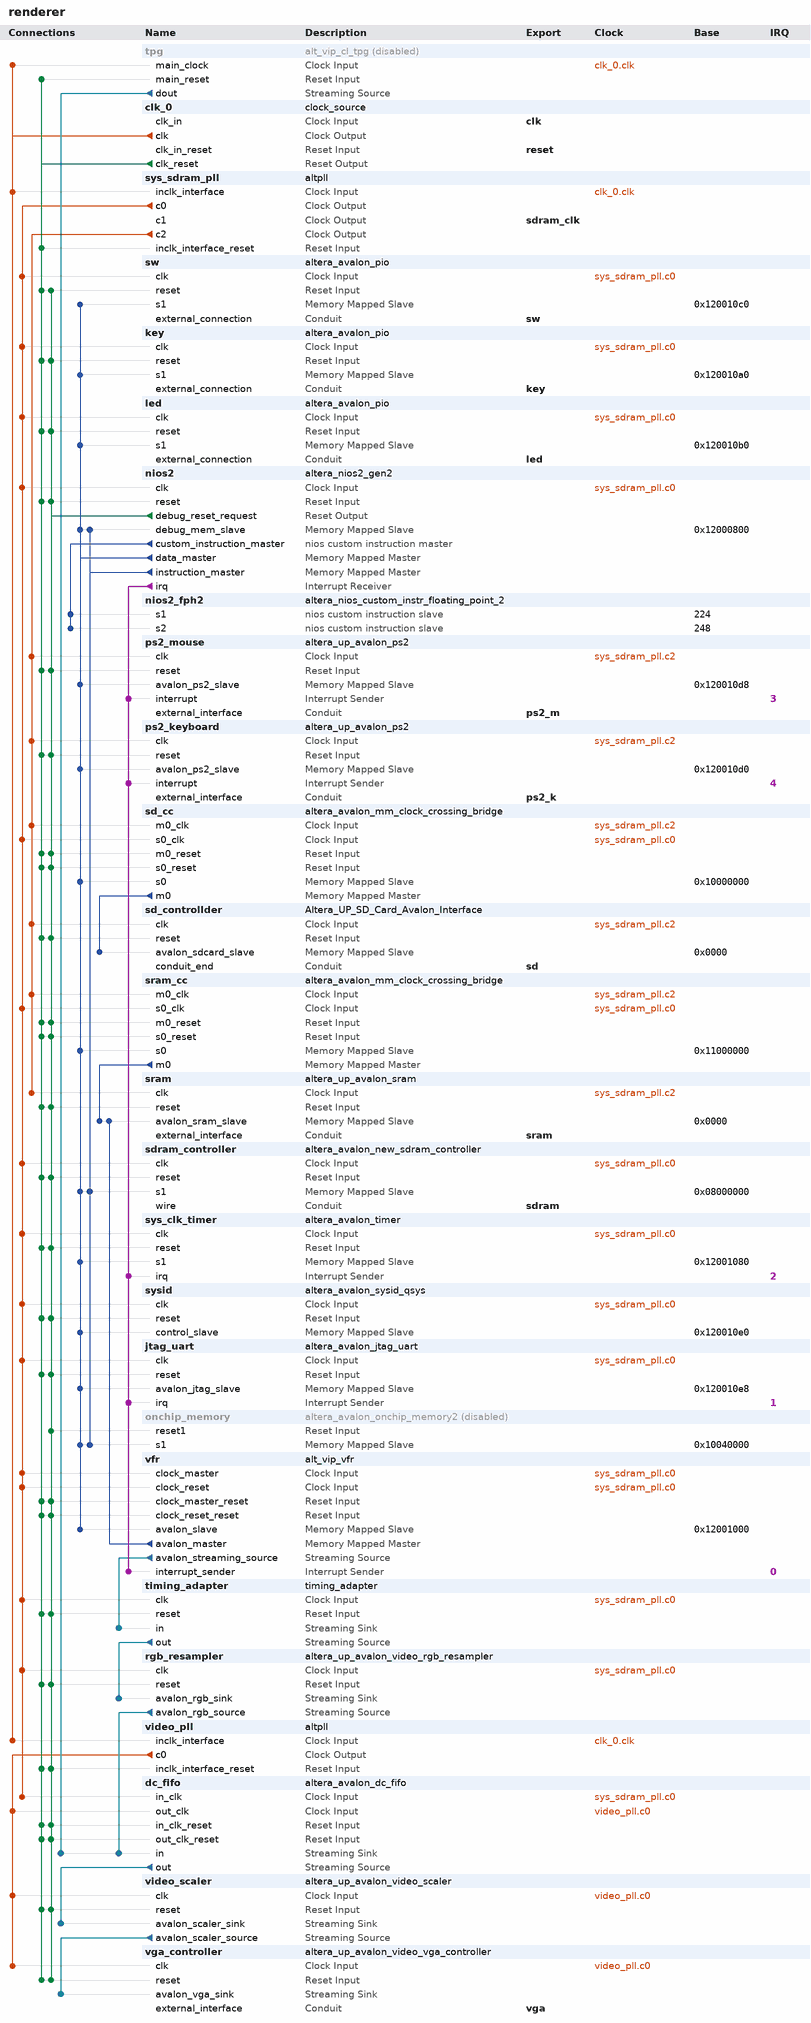
[diagram p0: system contents]
# Platform Designer (Qsys) system renderer, Cyclone IV E EP4CE115F29C7
# Parameters at their usual value, and those the tool derives, are not listed.
package require -exact qsys 16.1
create_system renderer
set_project_property DEVICE_FAMILY {Cyclone IV E}
set_project_property DEVICE EP4CE115F29C7

add_instance tpg alt_vip_cl_tpg 16.1
set_instance_property tpg ENABLED false
set_instance_parameter_value tpg BITS_PER_SYMBOL 8
set_instance_parameter_value tpg COLOR_PLANES_ARE_IN_PARALLEL 1
set_instance_parameter_value tpg COLOR_SPACE RGB
set_instance_parameter_value tpg FAMILY {Cyclone IV E}
set_instance_parameter_value tpg INTERLACING prog
set_instance_parameter_value tpg MAX_HEIGHT 480
set_instance_parameter_value tpg MAX_WIDTH 640
set_instance_parameter_value tpg NUMBER_OF_COLOR_PLANES 2
set_instance_parameter_value tpg OUTPUT_FORMAT 4.4.4
set_instance_parameter_value tpg PATTERN colorbars
set_instance_parameter_value tpg PIXELS_IN_PARALLEL 1
set_instance_parameter_value tpg RUNTIME_CONTROL 0
set_instance_parameter_value tpg UNIFORM_VALUE_BCR 16
set_instance_parameter_value tpg UNIFORM_VALUE_GCB 16
set_instance_parameter_value tpg UNIFORM_VALUE_RY 16

add_instance clk_0 clock_source 16.1
set_instance_parameter_value clk_0 clockFrequency 50000000

add_instance sys_sdram_pll altpll 16.1
set_instance_parameter_value sys_sdram_pll CLK0_DIVIDE_BY 5
set_instance_parameter_value sys_sdram_pll CLK0_MULTIPLY_BY 12
set_instance_parameter_value sys_sdram_pll CLK1_DIVIDE_BY 5
set_instance_parameter_value sys_sdram_pll CLK1_DUTY_CYCLE 50
set_instance_parameter_value sys_sdram_pll CLK1_MULTIPLY_BY 12
set_instance_parameter_value sys_sdram_pll CLK1_PHASE_SHIFT -3125
set_instance_parameter_value sys_sdram_pll CLK2_DIVIDE_BY 1
set_instance_parameter_value sys_sdram_pll CLK2_DUTY_CYCLE 50
set_instance_parameter_value sys_sdram_pll CLK2_MULTIPLY_BY 1
set_instance_parameter_value sys_sdram_pll CLK2_PHASE_SHIFT 0
set_instance_parameter_value sys_sdram_pll INCLK0_INPUT_FREQUENCY 20000
set_instance_parameter_value sys_sdram_pll PORT_ARESET PORT_USED
set_instance_parameter_value sys_sdram_pll PORT_LOCKED PORT_USED
set_instance_parameter_value sys_sdram_pll PORT_clk1 PORT_USED
set_instance_parameter_value sys_sdram_pll PORT_clk2 PORT_USED
set_instance_parameter_value sys_sdram_pll PORT_clk3 PORT_UNUSED

add_instance sw altera_avalon_pio 16.1
set_instance_parameter_value sw direction Input
set_instance_parameter_value sw width 18

add_instance key altera_avalon_pio 16.1
set_instance_parameter_value key direction Input
set_instance_parameter_value key width 4

add_instance led altera_avalon_pio 16.1
set_instance_parameter_value led direction Output
set_instance_parameter_value led width 18

add_instance nios2 altera_nios2_gen2 16.1
set_instance_parameter_value nios2 dcache_size 2048
set_instance_parameter_value nios2 exceptionSlave sdram_controller.s1
set_instance_parameter_value nios2 icache_size 4096
set_instance_parameter_value nios2 impl Fast
set_instance_parameter_value nios2 resetSlave sdram_controller.s1

add_instance nios2_fph2 altera_nios_custom_instr_floating_point_2 16.1
set_instance_parameter_value nios2_fph2 arithmetic_present true
set_instance_parameter_value nios2_fph2 comparison_present true
set_instance_parameter_value nios2_fph2 conversion_present true
set_instance_parameter_value nios2_fph2 root_present true

add_instance ps2_mouse altera_up_avalon_ps2 16.1

add_instance ps2_keyboard altera_up_avalon_ps2 16.1

add_instance sd_cc altera_avalon_mm_clock_crossing_bridge 16.1
set_instance_parameter_value sd_cc ADDRESS_WIDTH 10
set_instance_parameter_value sd_cc COMMAND_FIFO_DEPTH 4
set_instance_parameter_value sd_cc DATA_WIDTH 32
set_instance_parameter_value sd_cc MASTER_SYNC_DEPTH 2
set_instance_parameter_value sd_cc MAX_BURST_SIZE 1
set_instance_parameter_value sd_cc RESPONSE_FIFO_DEPTH 4
set_instance_parameter_value sd_cc SLAVE_SYNC_DEPTH 2
set_instance_parameter_value sd_cc USE_AUTO_ADDRESS_WIDTH 1

add_instance sd_controllder Altera_UP_SD_Card_Avalon_Interface 16.1

add_instance sram_cc altera_avalon_mm_clock_crossing_bridge 16.1
set_instance_parameter_value sram_cc ADDRESS_WIDTH 21
set_instance_parameter_value sram_cc COMMAND_FIFO_DEPTH 4
set_instance_parameter_value sram_cc DATA_WIDTH 32
set_instance_parameter_value sram_cc MASTER_SYNC_DEPTH 2
set_instance_parameter_value sram_cc MAX_BURST_SIZE 1
set_instance_parameter_value sram_cc RESPONSE_FIFO_DEPTH 4
set_instance_parameter_value sram_cc SLAVE_SYNC_DEPTH 2
set_instance_parameter_value sram_cc USE_AUTO_ADDRESS_WIDTH 1

add_instance sram altera_up_avalon_sram 16.1
set_instance_parameter_value sram board DE2-115
set_instance_parameter_value sram pixel_buffer true

add_instance sdram_controller altera_avalon_new_sdram_controller 16.1
set_instance_parameter_value sdram_controller TAC 5.4
set_instance_parameter_value sdram_controller TRCD 15.0
set_instance_parameter_value sdram_controller TRP 15.0
set_instance_parameter_value sdram_controller casLatency 3
set_instance_parameter_value sdram_controller columnWidth 10
set_instance_parameter_value sdram_controller dataWidth 32
set_instance_parameter_value sdram_controller generateSimulationModel false
set_instance_parameter_value sdram_controller model single_Micron_MT48LC4M32B2_7_chip
set_instance_parameter_value sdram_controller numberOfBanks 4
set_instance_parameter_value sdram_controller numberOfChipSelects 1
set_instance_parameter_value sdram_controller powerUpDelay 100.0
set_instance_parameter_value sdram_controller refreshPeriod 7.8125
set_instance_parameter_value sdram_controller rowWidth 13

add_instance sys_clk_timer altera_avalon_timer 16.1
set_instance_parameter_value sys_clk_timer period 1
set_instance_parameter_value sys_clk_timer periodUnits MSEC

add_instance sysid altera_avalon_sysid_qsys 16.1
set_instance_parameter_value sysid id 0

add_instance jtag_uart altera_avalon_jtag_uart 16.1
set_instance_parameter_value jtag_uart simInteractiveOptions NO_INTERACTIVE_WINDOWS

add_instance onchip_memory altera_avalon_onchip_memory2 16.1
set_instance_property onchip_memory ENABLED false
set_instance_parameter_value onchip_memory dataWidth 32
set_instance_parameter_value onchip_memory dualPort false
set_instance_parameter_value onchip_memory initMemContent true
set_instance_parameter_value onchip_memory initializationFileName onchip_mem.hex
set_instance_parameter_value onchip_memory memorySize 204800

add_instance vfr alt_vip_vfr 14.0
set_instance_parameter_value vfr MAX_IMAGE_HEIGHT 120
set_instance_parameter_value vfr MAX_IMAGE_WIDTH 160
set_instance_parameter_value vfr MEM_PORT_WIDTH 32
set_instance_parameter_value vfr NUMBER_OF_CHANNELS_IN_PARALLEL 3
set_instance_parameter_value vfr RMASTER_BURST_TARGET 128
set_instance_parameter_value vfr RMASTER_FIFO_DEPTH 256

add_instance timing_adapter timing_adapter 16.1
set_instance_parameter_value timing_adapter inBitsPerSymbol 8
set_instance_parameter_value timing_adapter inChannelWidth 0
set_instance_parameter_value timing_adapter inErrorWidth 0
set_instance_parameter_value timing_adapter inMaxChannel 0
set_instance_parameter_value timing_adapter inReadyLatency 1
set_instance_parameter_value timing_adapter inSymbolsPerBeat 3
set_instance_parameter_value timing_adapter inUseEmptyPort NO
set_instance_parameter_value timing_adapter inUsePackets true
set_instance_parameter_value timing_adapter inUseReady true
set_instance_parameter_value timing_adapter inUseValid true
set_instance_parameter_value timing_adapter outReadyLatency 1
set_instance_parameter_value timing_adapter outUseReady true
set_instance_parameter_value timing_adapter outUseValid true

add_instance rgb_resampler altera_up_avalon_video_rgb_resampler 16.1
set_instance_parameter_value rgb_resampler alpha 1023
set_instance_parameter_value rgb_resampler input_type {24-bit RGB}
set_instance_parameter_value rgb_resampler output_type {30-bit RGB}

add_instance video_pll altpll 16.1
set_instance_parameter_value video_pll CLK0_DIVIDE_BY 2
set_instance_parameter_value video_pll CLK0_MULTIPLY_BY 1
set_instance_parameter_value video_pll INCLK0_INPUT_FREQUENCY 20000
set_instance_parameter_value video_pll PORT_ARESET PORT_USED
set_instance_parameter_value video_pll PORT_LOCKED PORT_USED
set_instance_parameter_value video_pll PORT_clk1 PORT_UNUSED
set_instance_parameter_value video_pll PORT_clk2 PORT_UNUSED
set_instance_parameter_value video_pll PORT_clk3 PORT_UNUSED

add_instance dc_fifo altera_avalon_dc_fifo 16.1
set_instance_parameter_value dc_fifo BITS_PER_SYMBOL 10
set_instance_parameter_value dc_fifo FIFO_DEPTH 256
set_instance_parameter_value dc_fifo SYMBOLS_PER_BEAT 3
set_instance_parameter_value dc_fifo USE_PACKETS 1

add_instance video_scaler altera_up_avalon_video_scaler 16.1
set_instance_parameter_value video_scaler color_bits 10
set_instance_parameter_value video_scaler color_planes 3
set_instance_parameter_value video_scaler height_in 120
set_instance_parameter_value video_scaler height_scaling 4
set_instance_parameter_value video_scaler width_in 160
set_instance_parameter_value video_scaler width_scaling 4

add_instance vga_controller altera_up_avalon_video_vga_controller 16.1
set_instance_parameter_value vga_controller board DE2-115
set_instance_parameter_value vga_controller resolution {VGA 640x480}

# connections
add_connection clk_0.clk sys_sdram_pll.inclk_interface clock
add_connection clk_0.clk tpg.main_clock clock
add_connection clk_0.clk video_pll.inclk_interface clock
add_connection sys_sdram_pll.c0 dc_fifo.in_clk clock
add_connection sys_sdram_pll.c0 jtag_uart.clk clock
add_connection sys_sdram_pll.c0 key.clk clock
add_connection sys_sdram_pll.c0 led.clk clock
add_connection sys_sdram_pll.c0 nios2.clk clock
add_connection sys_sdram_pll.c0 rgb_resampler.clk clock
add_connection sys_sdram_pll.c0 sd_cc.s0_clk clock
add_connection sys_sdram_pll.c0 sdram_controller.clk clock
add_connection sys_sdram_pll.c0 sram_cc.s0_clk clock
add_connection sys_sdram_pll.c0 sw.clk clock
add_connection sys_sdram_pll.c0 sys_clk_timer.clk clock
add_connection sys_sdram_pll.c0 sysid.clk clock
add_connection sys_sdram_pll.c0 timing_adapter.clk clock
add_connection sys_sdram_pll.c0 vfr.clock_master clock
add_connection sys_sdram_pll.c0 vfr.clock_reset clock
add_connection sys_sdram_pll.c2 ps2_keyboard.clk clock
add_connection sys_sdram_pll.c2 ps2_mouse.clk clock
add_connection sys_sdram_pll.c2 sd_cc.m0_clk clock
add_connection sys_sdram_pll.c2 sd_controllder.clk clock
add_connection sys_sdram_pll.c2 sram.clk clock
add_connection sys_sdram_pll.c2 sram_cc.m0_clk clock
add_connection video_pll.c0 dc_fifo.out_clk clock
add_connection video_pll.c0 vga_controller.clk clock
add_connection video_pll.c0 video_scaler.clk clock
add_connection clk_0.clk_reset dc_fifo.in_clk_reset reset
add_connection clk_0.clk_reset dc_fifo.out_clk_reset reset
add_connection clk_0.clk_reset jtag_uart.reset reset
add_connection clk_0.clk_reset key.reset reset
add_connection clk_0.clk_reset led.reset reset
add_connection clk_0.clk_reset nios2.reset reset
add_connection clk_0.clk_reset ps2_keyboard.reset reset
add_connection clk_0.clk_reset ps2_mouse.reset reset
add_connection clk_0.clk_reset rgb_resampler.reset reset
add_connection clk_0.clk_reset sd_cc.m0_reset reset
add_connection clk_0.clk_reset sd_cc.s0_reset reset
add_connection clk_0.clk_reset sd_controllder.reset reset
add_connection clk_0.clk_reset sdram_controller.reset reset
add_connection clk_0.clk_reset sram.reset reset
add_connection clk_0.clk_reset sram_cc.m0_reset reset
add_connection clk_0.clk_reset sram_cc.s0_reset reset
add_connection clk_0.clk_reset sw.reset reset
add_connection clk_0.clk_reset sys_clk_timer.reset reset
add_connection clk_0.clk_reset sys_sdram_pll.inclk_interface_reset reset
add_connection clk_0.clk_reset sysid.reset reset
add_connection clk_0.clk_reset timing_adapter.reset reset
add_connection clk_0.clk_reset tpg.main_reset reset
add_connection clk_0.clk_reset vfr.clock_master_reset reset
add_connection clk_0.clk_reset vfr.clock_reset_reset reset
add_connection clk_0.clk_reset vga_controller.reset reset
add_connection clk_0.clk_reset video_pll.inclk_interface_reset reset
add_connection clk_0.clk_reset video_scaler.reset reset
add_connection nios2.debug_reset_request dc_fifo.in_clk_reset reset
add_connection nios2.debug_reset_request dc_fifo.out_clk_reset reset
add_connection nios2.debug_reset_request jtag_uart.reset reset
add_connection nios2.debug_reset_request key.reset reset
add_connection nios2.debug_reset_request led.reset reset
add_connection nios2.debug_reset_request nios2.reset reset
add_connection nios2.debug_reset_request onchip_memory.reset1 reset
add_connection nios2.debug_reset_request ps2_keyboard.reset reset
add_connection nios2.debug_reset_request ps2_mouse.reset reset
add_connection nios2.debug_reset_request rgb_resampler.reset reset
add_connection nios2.debug_reset_request sd_cc.m0_reset reset
add_connection nios2.debug_reset_request sd_cc.s0_reset reset
add_connection nios2.debug_reset_request sd_controllder.reset reset
add_connection nios2.debug_reset_request sdram_controller.reset reset
add_connection nios2.debug_reset_request sram.reset reset
add_connection nios2.debug_reset_request sram_cc.m0_reset reset
add_connection nios2.debug_reset_request sram_cc.s0_reset reset
add_connection nios2.debug_reset_request sw.reset reset
add_connection nios2.debug_reset_request sys_clk_timer.reset reset
add_connection nios2.debug_reset_request sysid.reset reset
add_connection nios2.debug_reset_request timing_adapter.reset reset
add_connection nios2.debug_reset_request vfr.clock_master_reset reset
add_connection nios2.debug_reset_request vfr.clock_reset_reset reset
add_connection nios2.debug_reset_request vga_controller.reset reset
add_connection nios2.debug_reset_request video_pll.inclk_interface_reset reset
add_connection nios2.debug_reset_request video_scaler.reset reset
add_connection nios2.data_master jtag_uart.avalon_jtag_slave avalon
set_connection_parameter_value nios2.data_master/jtag_uart.avalon_jtag_slave baseAddress 0x120010e8
add_connection nios2.data_master key.s1 avalon
set_connection_parameter_value nios2.data_master/key.s1 baseAddress 0x120010a0
add_connection nios2.data_master led.s1 avalon
set_connection_parameter_value nios2.data_master/led.s1 baseAddress 0x120010b0
add_connection nios2.data_master nios2.debug_mem_slave avalon
set_connection_parameter_value nios2.data_master/nios2.debug_mem_slave baseAddress 0x12000800
add_connection nios2.data_master onchip_memory.s1 avalon
set_connection_parameter_value nios2.data_master/onchip_memory.s1 baseAddress 0x10040000
add_connection nios2.data_master ps2_keyboard.avalon_ps2_slave avalon
set_connection_parameter_value nios2.data_master/ps2_keyboard.avalon_ps2_slave baseAddress 0x120010d0
add_connection nios2.data_master ps2_mouse.avalon_ps2_slave avalon
set_connection_parameter_value nios2.data_master/ps2_mouse.avalon_ps2_slave baseAddress 0x120010d8
add_connection nios2.data_master sd_cc.s0 avalon
set_connection_parameter_value nios2.data_master/sd_cc.s0 baseAddress 0x10000000
add_connection nios2.data_master sdram_controller.s1 avalon
set_connection_parameter_value nios2.data_master/sdram_controller.s1 baseAddress 0x08000000
add_connection nios2.data_master sram_cc.s0 avalon
set_connection_parameter_value nios2.data_master/sram_cc.s0 baseAddress 0x11000000
add_connection nios2.data_master sw.s1 avalon
set_connection_parameter_value nios2.data_master/sw.s1 baseAddress 0x120010c0
add_connection nios2.data_master sys_clk_timer.s1 avalon
set_connection_parameter_value nios2.data_master/sys_clk_timer.s1 baseAddress 0x12001080
add_connection nios2.data_master sysid.control_slave avalon
set_connection_parameter_value nios2.data_master/sysid.control_slave baseAddress 0x120010e0
add_connection nios2.data_master vfr.avalon_slave avalon
set_connection_parameter_value nios2.data_master/vfr.avalon_slave baseAddress 0x12001000
add_connection nios2.instruction_master nios2.debug_mem_slave avalon
set_connection_parameter_value nios2.instruction_master/nios2.debug_mem_slave baseAddress 0x12000800
add_connection nios2.instruction_master onchip_memory.s1 avalon
set_connection_parameter_value nios2.instruction_master/onchip_memory.s1 baseAddress 0x10040000
add_connection nios2.instruction_master sdram_controller.s1 avalon
set_connection_parameter_value nios2.instruction_master/sdram_controller.s1 baseAddress 0x08000000
add_connection sd_cc.m0 sd_controllder.avalon_sdcard_slave avalon
set_connection_parameter_value sd_cc.m0/sd_controllder.avalon_sdcard_slave baseAddress 0x0000
add_connection sram_cc.m0 sram.avalon_sram_slave avalon
set_connection_parameter_value sram_cc.m0/sram.avalon_sram_slave baseAddress 0x0000
add_connection vfr.avalon_master sram.avalon_sram_slave avalon
set_connection_parameter_value vfr.avalon_master/sram.avalon_sram_slave baseAddress 0x0000
add_connection dc_fifo.out video_scaler.avalon_scaler_sink avalon_streaming
add_connection rgb_resampler.avalon_rgb_source dc_fifo.in avalon_streaming
add_connection timing_adapter.out rgb_resampler.avalon_rgb_sink avalon_streaming
add_connection tpg.dout dc_fifo.in avalon_streaming
add_connection vfr.avalon_streaming_source timing_adapter.in avalon_streaming
add_connection video_scaler.avalon_scaler_source vga_controller.avalon_vga_sink avalon_streaming
add_connection nios2.irq jtag_uart.irq interrupt
set_connection_parameter_value nios2.irq/jtag_uart.irq irqNumber 1
add_connection nios2.irq ps2_keyboard.interrupt interrupt
set_connection_parameter_value nios2.irq/ps2_keyboard.interrupt irqNumber 4
add_connection nios2.irq ps2_mouse.interrupt interrupt
set_connection_parameter_value nios2.irq/ps2_mouse.interrupt irqNumber 3
add_connection nios2.irq sys_clk_timer.irq interrupt
set_connection_parameter_value nios2.irq/sys_clk_timer.irq irqNumber 2
add_connection nios2.irq vfr.interrupt_sender interrupt
set_connection_parameter_value nios2.irq/vfr.interrupt_sender irqNumber 0
add_connection nios2.custom_instruction_master nios2_fph2.s1 nios_custom_instruction
set_connection_parameter_value nios2.custom_instruction_master/nios2_fph2.s1 CIName nios2_fph2
set_connection_parameter_value nios2.custom_instruction_master/nios2_fph2.s1 baseAddress 224
add_connection nios2.custom_instruction_master nios2_fph2.s2 nios_custom_instruction
set_connection_parameter_value nios2.custom_instruction_master/nios2_fph2.s2 CIName nios2_fph2_1
set_connection_parameter_value nios2.custom_instruction_master/nios2_fph2.s2 baseAddress 248

# exported interfaces
add_interface clk clock sink
set_interface_property clk EXPORT_OF clk_0.clk_in
add_interface key conduit end
set_interface_property key EXPORT_OF key.external_connection
add_interface led conduit end
set_interface_property led EXPORT_OF led.external_connection
add_interface ps2_k conduit end
set_interface_property ps2_k EXPORT_OF ps2_keyboard.external_interface
add_interface ps2_m conduit end
set_interface_property ps2_m EXPORT_OF ps2_mouse.external_interface
add_interface reset reset sink
set_interface_property reset EXPORT_OF clk_0.clk_in_reset
add_interface sd conduit end
set_interface_property sd EXPORT_OF sd_controllder.conduit_end
add_interface sdram conduit end
set_interface_property sdram EXPORT_OF sdram_controller.wire
add_interface sdram_clk clock source
set_interface_property sdram_clk EXPORT_OF sys_sdram_pll.c1
add_interface sram conduit end
set_interface_property sram EXPORT_OF sram.external_interface
add_interface sw conduit end
set_interface_property sw EXPORT_OF sw.external_connection
add_interface vga conduit end
set_interface_property vga EXPORT_OF vga_controller.external_interface

set_interconnect_requirement {$system} qsys_mm.clockCrossingAdapter HANDSHAKE
set_interconnect_requirement {$system} qsys_mm.enableEccProtection FALSE
set_interconnect_requirement {$system} qsys_mm.insertDefaultSlave FALSE
set_interconnect_requirement {$system} qsys_mm.maxAdditionalLatency 1

save_system renderer.qsys
